# EAGLE schematic 9x9 LED Matrix (EAGLE 6.3)
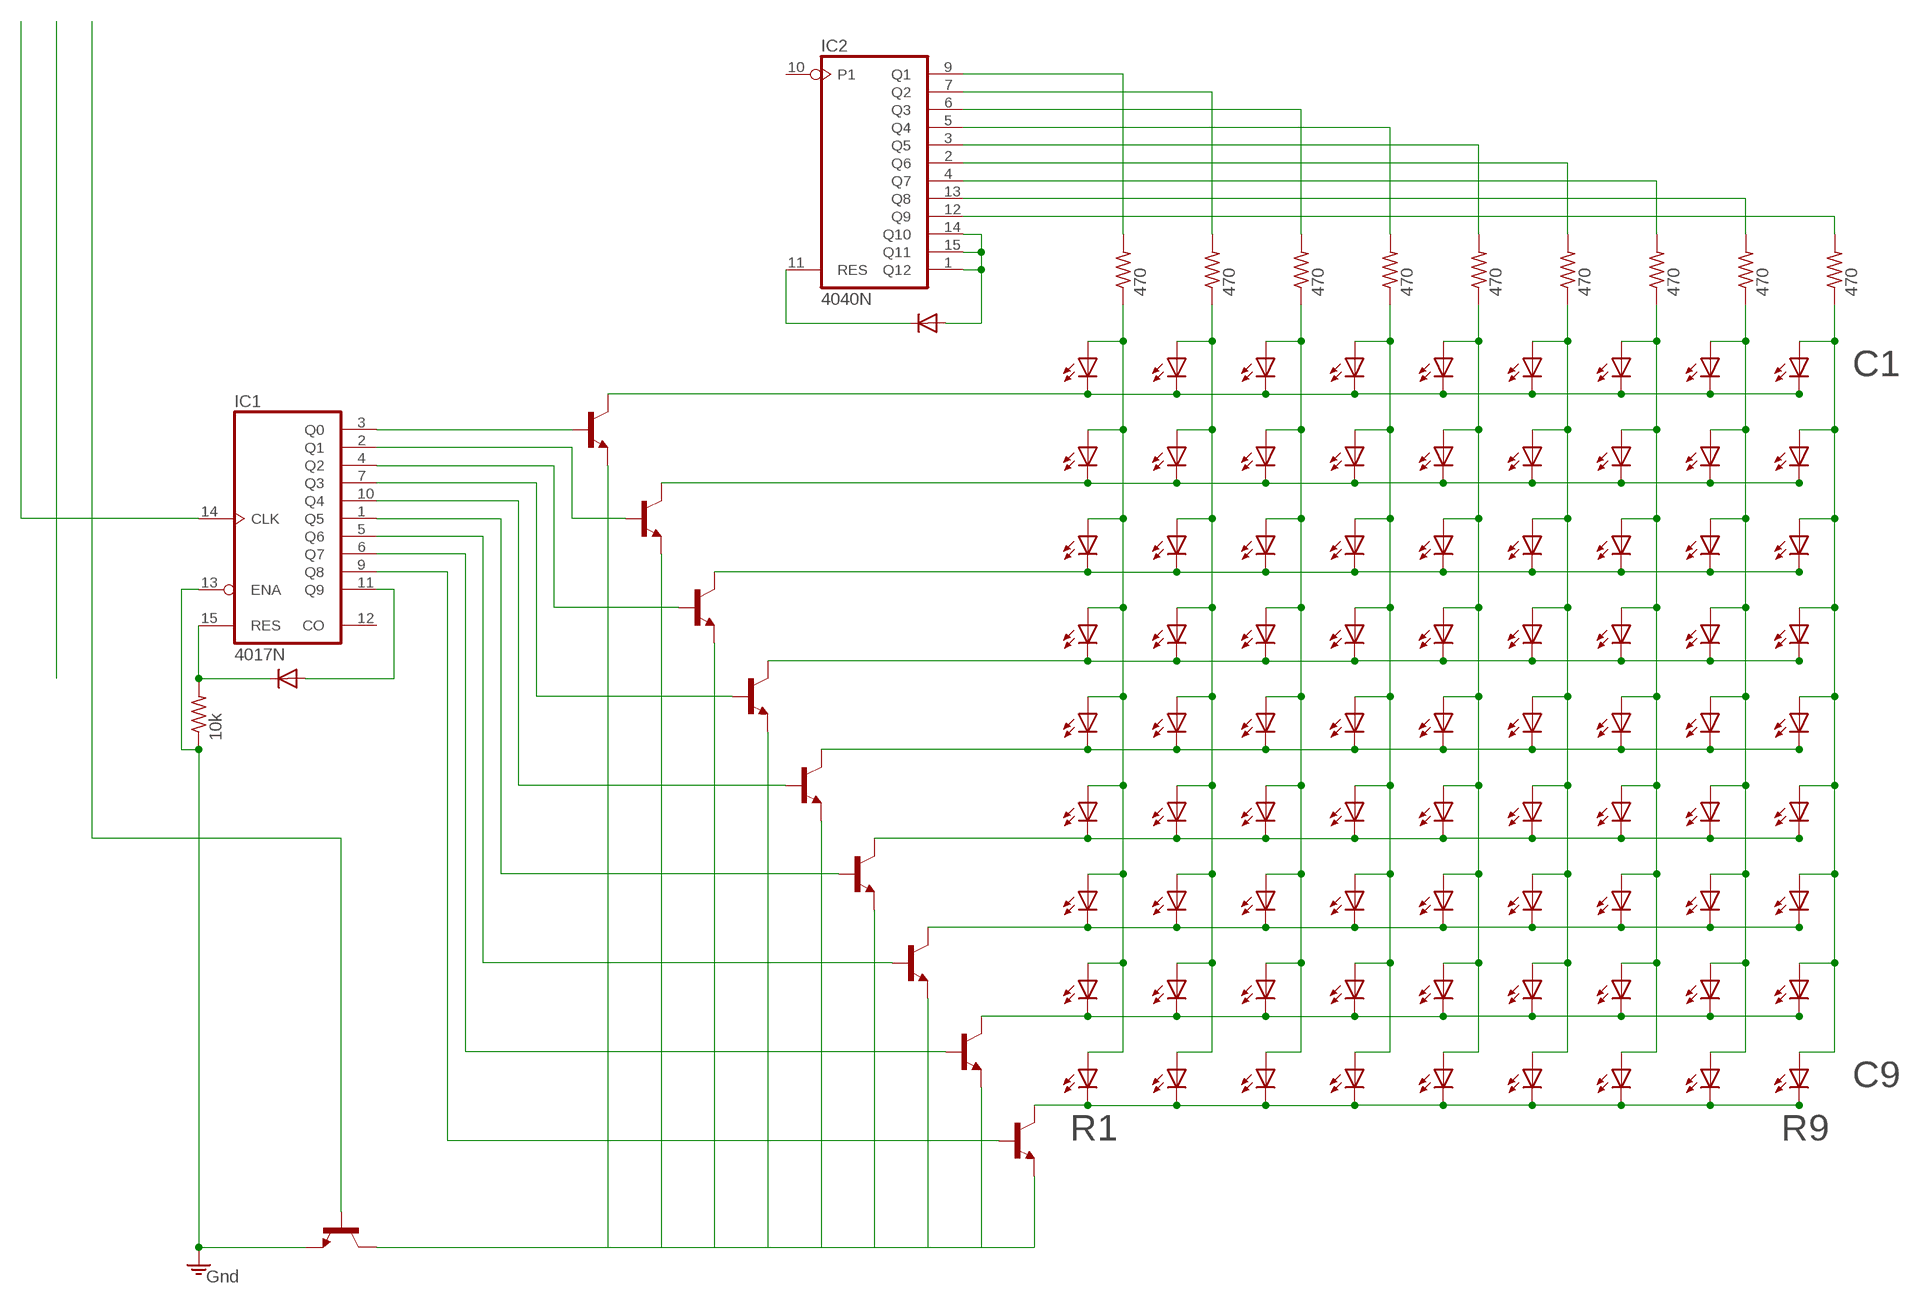
[diagram p0: schematic, sheet 1]

## Parts
D1  1N4004  [DO41-10]
D2  1N4004  [DO41-10]
IC1  4017N  [DIL16]
IC2  4040N  [DIL16]
LED1  TLLG4400  [LED3MM]
LED2  TLLG4400  [LED3MM]
LED3  TLLG4400  [LED3MM]
LED4  TLLG4400  [LED3MM]
LED5  TLLG4400  [LED3MM]
LED6  TLLG4400  [LED3MM]
LED7  TLLG4400  [LED3MM]
LED8  TLLG4400  [LED3MM]
LED9  TLLG4400  [LED3MM]
LED10  TLLG4400  [LED3MM]
LED11  TLLG4400  [LED3MM]
LED12  TLLG4400  [LED3MM]
LED13  TLLG4400  [LED3MM]
LED14  TLLG4400  [LED3MM]
LED15  TLLG4400  [LED3MM]
LED16  TLLG4400  [LED3MM]
LED17  TLLG4400  [LED3MM]
LED18  TLLG4400  [LED3MM]
LED19  TLLG4400  [LED3MM]
LED20  TLLG4400  [LED3MM]
LED21  TLLG4400  [LED3MM]
LED22  TLLG4400  [LED3MM]
LED23  TLLG4400  [LED3MM]
LED24  TLLG4400  [LED3MM]
LED25  TLLG4400  [LED3MM]
LED26  TLLG4400  [LED3MM]
LED27  TLLG4400  [LED3MM]
LED28  TLLG4400  [LED3MM]
LED29  TLLG4400  [LED3MM]
LED30  TLLG4400  [LED3MM]
LED31  TLLG4400  [LED3MM]
LED32  TLLG4400  [LED3MM]
LED33  TLLG4400  [LED3MM]
LED34  TLLG4400  [LED3MM]
LED35  TLLG4400  [LED3MM]
LED36  TLLG4400  [LED3MM]
LED37  TLLG4400  [LED3MM]
LED38  TLLG4400  [LED3MM]
LED39  TLLG4400  [LED3MM]
LED40  TLLG4400  [LED3MM]
LED41  TLLG4400  [LED3MM]
LED42  TLLG4400  [LED3MM]
LED43  TLLG4400  [LED3MM]
LED44  TLLG4400  [LED3MM]
LED45  TLLG4400  [LED3MM]
LED46  TLLG4400  [LED3MM]
LED47  TLLG4400  [LED3MM]
LED48  TLLG4400  [LED3MM]
LED49  TLLG4400  [LED3MM]
LED50  TLLG4400  [LED3MM]
LED51  TLLG4400  [LED3MM]
LED52  TLLG4400  [LED3MM]
LED53  TLLG4400  [LED3MM]
LED54  TLLG4400  [LED3MM]
LED55  TLLG4400  [LED3MM]
LED56  TLLG4400  [LED3MM]
LED57  TLLG4400  [LED3MM]
LED58  TLLG4400  [LED3MM]
LED59  TLLG4400  [LED3MM]
LED60  TLLG4400  [LED3MM]
LED61  TLLG4400  [LED3MM]
LED62  TLLG4400  [LED3MM]
LED63  TLLG4400  [LED3MM]
LED64  TLLG4400  [LED3MM]
LED65  TLLG4400  [LED3MM]
LED66  TLLG4400  [LED3MM]
LED67  TLLG4400  [LED3MM]
LED68  TLLG4400  [LED3MM]
LED69  TLLG4400  [LED3MM]
LED70  TLLG4400  [LED3MM]
LED71  TLLG4400  [LED3MM]
LED72  TLLG4400  [LED3MM]
LED73  TLLG4400  [LED3MM]
LED74  TLLG4400  [LED3MM]
LED75  TLLG4400  [LED3MM]
LED76  TLLG4400  [LED3MM]
LED77  TLLG4400  [LED3MM]
LED78  TLLG4400  [LED3MM]
LED79  TLLG4400  [LED3MM]
LED80  TLLG4400  [LED3MM]
LED81  TLLG4400  [LED3MM]
R1  10k  R-US_0204/7  [0204/7]
R10  470  R-US_0204/7  [0204/7]
R11  470  R-US_0204/7  [0204/7]
R12  470  R-US_0204/7  [0204/7]
R13  470  R-US_0204/7  [0204/7]
R14  470  R-US_0204/7  [0204/7]
R15  470  R-US_0204/7  [0204/7]
R16  470  R-US_0204/7  [0204/7]
R17  470  R-US_0204/7  [0204/7]
R18  470  R-US_0204/7  [0204/7]
T1  2N2222  [TO18]
T2  2N2222  [TO18]
T3  2N2222  [TO18]
T4  2N2222  [TO18]
T5  2N2222  [TO18]
T6  2N2222  [TO18]
T7  2N2222  [TO18]
T8  2N2222  [TO18]
T9  2N2222  [TO18]
T10  2N2222  [TO18]
U$1  GND  [GND]

## Nets
N$1: LED1.K(C) LED2.K(C) LED3.K(C) LED4.K(C) LED5.K(C) LED6.K(C) LED7.K(C) LED8.K(C) LED9.K(C) T1.3(C)
N$2: LED10.K(C) LED11.K(C) LED12.K(C) LED13.K(C) LED14.K(C) LED15.K(C) LED16.K(C) LED17.K(C) LED18.K(C) T2.3(C)
N$3: LED19.K(C) LED20.K(C) LED21.K(C) LED22.K(C) LED23.K(C) LED24.K(C) LED25.K(C) LED26.K(C) LED27.K(C) T3.3(C)
N$4: LED28.K(C) LED29.K(C) LED30.K(C) LED31.K(C) LED32.K(C) LED33.K(C) LED34.K(C) LED35.K(C) LED36.K(C) T4.3(C)
N$5: LED37.K(C) LED38.K(C) LED39.K(C) LED40.K(C) LED41.K(C) LED42.K(C) LED43.K(C) LED44.K(C) LED45.K(C) T9.3(C)
N$6: LED46.K(C) LED47.K(C) LED48.K(C) LED49.K(C) LED50.K(C) LED51.K(C) LED52.K(C) LED53.K(C) LED54.K(C) T5.3(C)
N$7: LED55.K(C) LED56.K(C) LED57.K(C) LED58.K(C) LED59.K(C) LED60.K(C) LED61.K(C) LED62.K(C) LED63.K(C) T6.3(C)
N$8: LED64.K(C) LED65.K(C) LED66.K(C) LED67.K(C) LED68.K(C) LED69.K(C) LED70.K(C) LED71.K(C) LED72.K(C) T7.3(C)
N$9: LED73.K(C) LED74.K(C) LED75.K(C) LED76.K(C) LED77.K(C) LED78.K(C) LED79.K(C) LED80.K(C) LED81.K(C) T8.3(C)
N$10: T1.1(E)
N$11: T2.1(E)
N$12: T3.1(E)
N$13: T4.1(E)
N$14: T9.1(E)
N$15: T5.1(E)
N$16: T6.1(E)
N$17: T7.1(E)
N$18: IC1.13(ENA) R1.1 T10.1(E) U$1.P$1
N$19: IC1.9(Q8) T8.2(B)
N$20: IC1.6(Q7) T7.2(B)
N$21: IC1.5(Q6) T6.2(B)
N$22: IC1.1(Q5) T5.2(B)
N$23: IC1.10(Q4) T9.2(B)
N$24: IC1.7(Q3) T4.2(B)
N$25: IC1.4(Q2) T3.2(B)
N$26: IC1.2(Q1) T2.2(B)
N$27: IC2.9(Q1) R16.2
N$28: LED9.A LED18.A LED27.A LED36.A LED45.A LED54.A LED63.A LED72.A LED81.A R13.1
N$29: LED1.A LED10.A LED19.A LED28.A LED37.A LED46.A LED55.A LED64.A LED73.A R12.1
N$30: LED2.A LED11.A LED20.A LED29.A LED38.A LED47.A LED56.A LED65.A LED74.A R14.1
N$31: LED3.A LED12.A LED21.A LED30.A LED39.A LED48.A LED57.A LED66.A LED75.A R18.1
N$32: LED4.A LED13.A LED22.A LED31.A LED40.A LED49.A LED58.A LED67.A LED76.A R10.1
N$33: LED5.A LED14.A LED23.A LED32.A LED41.A LED50.A LED59.A LED68.A LED77.A R16.1
N$34: LED6.A LED15.A LED24.A LED33.A LED42.A LED51.A LED60.A LED69.A LED78.A R15.1
N$35: LED7.A LED16.A LED25.A LED34.A LED43.A LED52.A LED61.A LED70.A LED79.A R11.1
N$36: LED8.A LED17.A LED26.A LED35.A LED44.A LED53.A LED62.A LED71.A LED80.A R17.1
N$37: D2.A IC2.1(Q12) IC2.14(Q10) IC2.15(Q11)
N$38: D1.A IC1.11(Q9)
N$39: IC2.7(Q2) R15.2
N$40: IC2.6(Q3) R11.2
N$41: IC2.5(Q4) R17.2
N$42: IC2.3(Q5) R13.2
N$43: IC2.2(Q6) R12.2
N$44: IC2.4(Q7) R14.2
N$45: IC2.13(Q8) R18.2
N$46: IC2.12(Q9) R10.2
N$48: D2.C IC2.11(RES)
N$49: IC1.3(Q0) T1.2(B)
N$50: T8.1(E)
N$51: T10.2(B)
N$52: IC1.14(CLK)
N$53: D1.C IC1.15(RES) R1.2
Unconnected: IC1.12(CO) IC2.10(P1) T10.3(C)

## Notes on the sheet
- C1
- C9
- R1 | R9

## Power pins joined to a net without a drawn wire
VDD: IC1.16(VDD) IC2.16(VDD)
VSS: IC1.8(VSS) IC2.8(VSS)

## Library data of the parts
D1 D2 = diode:1N4004: DIODE general purpose rectifier, 1 A
IC1 = 40xx:4017: COUNTER/DIVIDER
IC2 = 40xx:4040: 12-stage binary/ripple COUNTER
LED1-LED81 = led:TLLG4400: Low Current (2mA) LED 3 mm Tinted Diffused Package color GREEN Source: Data sheet <http://www.farnell.com/datasheets/391098.pdf>; MF: VISHAY SEMICONDUCTOR; OC_FARNELL: 1612435
R1 R10-R18 = rcl:R-US_: RESISTOR, American symbol
T1-T10 = transistor:2N2222: NPN TRANSISTOR
U$1 = 001 Custom Lib.:GND: the Ground, Gnd,American symbol